# Altium schematic sheet IMX_Supporting Circuits.SchDoc
size A4; SheetNumber: 1; SheetTotal: 8
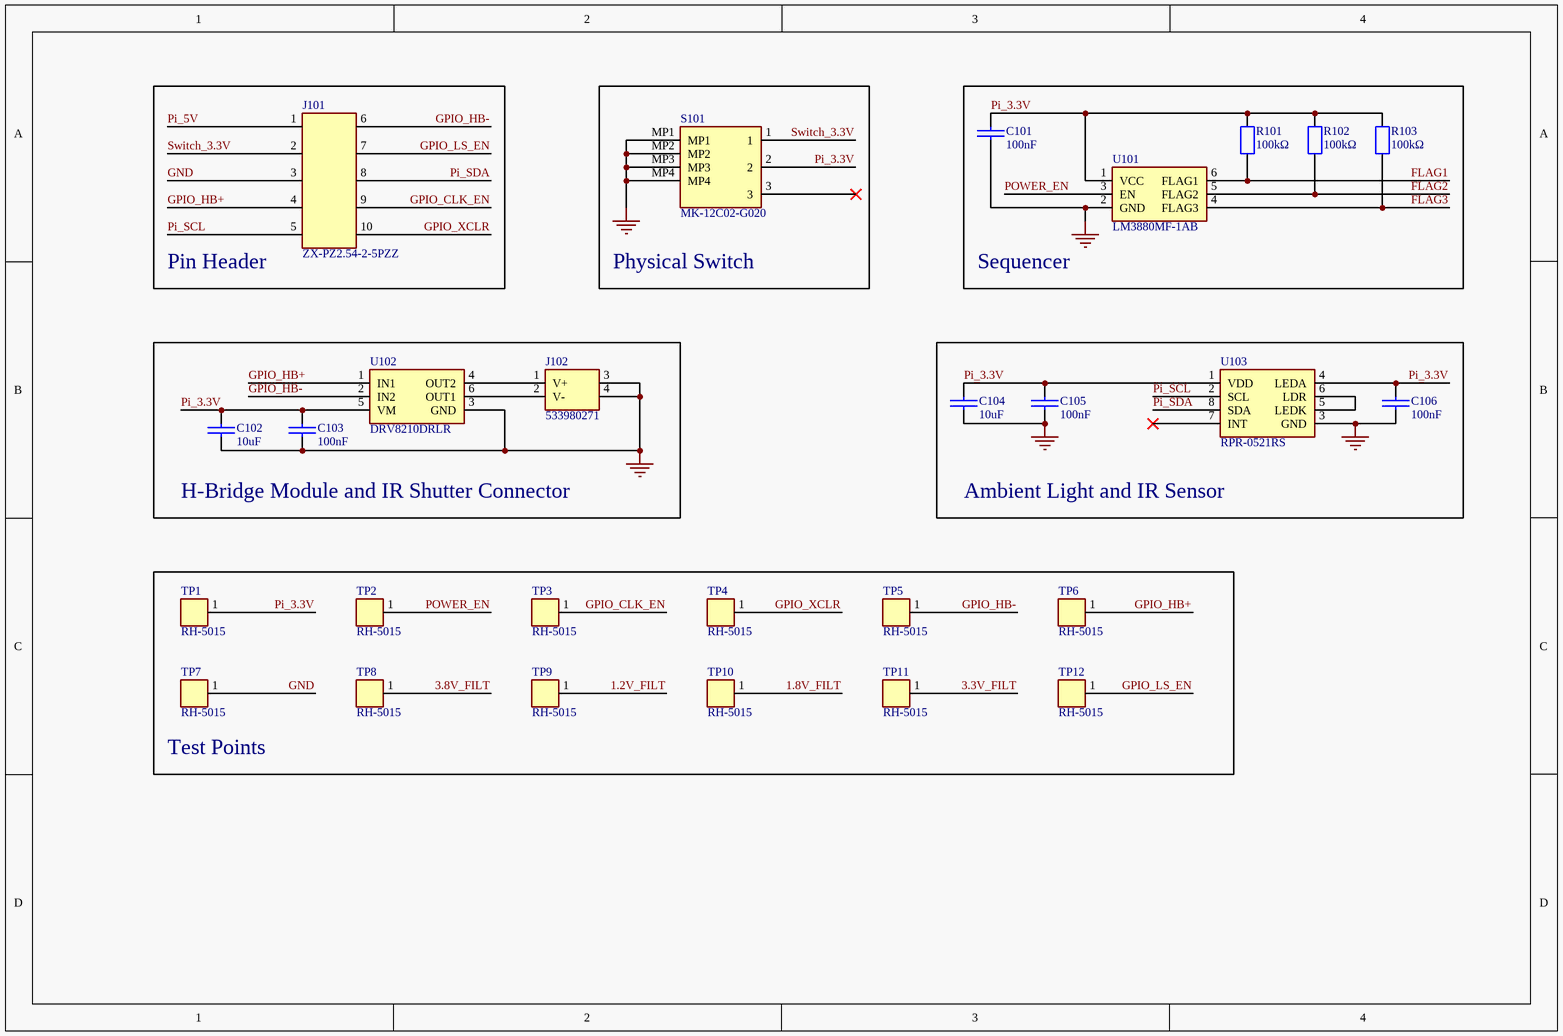
[diagram p0: IMX_Supporting Circuits.SchDoc]

## Parts
C101  100nF  [Capacitor, 0402]
C102  10uF  [Capacitor, 0603]
C103  100nF  [Capacitor, 0402]
C104  10uF  [Capacitor, 0603]
C105  100nF  [Capacitor, 0402]
C106  100nF  [Capacitor, 0402]
J101  ZX-PZ2.54-2-5PZZ  [Pin Header, DIP 2x5, 2.54mm]
J102  533980271  [Molex PicoBlade, Wire To Board 1x2, 533980271]
R101  100kΩ  [Resistor, 0603, Yageo]
R102  100kΩ  [Resistor, 0603, Yageo]
R103  100kΩ  [Resistor, 0603, Yageo]
S101  MK-12C02-G020  [Swich, 1A, Single Pole Double Throw, MK-12C02-G020]
TP1  RH-5015  [Test Point]
TP2  RH-5015  [Test Point]
TP3  RH-5015  [Test Point]
TP4  RH-5015  [Test Point]
TP5  RH-5015  [Test Point]
TP6  RH-5015  [Test Point]
TP7  RH-5015  [Test Point]
TP8  RH-5015  [Test Point]
TP9  RH-5015  [Test Point]
TP10  RH-5015  [Test Point]
TP11  RH-5015  [Test Point]
TP12  RH-5015  [Test Point]
U101  LM3880MF-1AB  [Sequencer, SOT-23]
U102  DRV8210DRLR  [H-Bridge, SOT-563]
U103  RPR-0521RS  [Rohm ALS]

## Blocks framed on the sheet
Pin Header: J101
Physical Switch: S101
Sequencer: C101 R101-R103 U101
H-Bridge Module and IR Shutter Connector: C102 C103 J102 U102
Ambient Light and IR Sensor: C104-C106 U103
Test Points: TP1-TP12

## Nets
GND: C101.2 C102.2 C103.2 C104.2 C105.2 C106.2 J101.3 J102.3 J102.4 S101.MP1 S101.MP2 S101.MP3 S101.MP4 TP7.1 U101.2(GND) U102.3(GND) U103.3(GND)
1.2V_FILT: TP9.1
1.8V_FILT: TP10.1
3.3V_FILT: TP11.1
3.8V_FILT: TP8.1
FLAG1: R101.1 U101.6(FLAG1)
FLAG2: R102.1 U101.5(FLAG2)
FLAG3: R103.1 U101.4(FLAG3)
GPIO_CLK_EN: J101.9 TP3.1
GPIO_HB+: J101.4 TP6.1 U102.1(IN1)
GPIO_HB-: J101.6 TP5.1 U102.2(IN2)
GPIO_LS_EN: J101.7 TP12.1
GPIO_XCLR: J101.10 TP4.1
Pi_3.3V: C101.1 C102.1 C103.1 C104.1 C105.1 C106.1 R101.2 R102.2 R103.2 S101.2 TP1.1 U101.1(VCC) U102.5(VM) U103.1(VDD) U103.4(LEDA)
Pi_5V: J101.1
Pi_SCL: J101.5 U103.2(SCL)
Pi_SDA: J101.8 U103.8(SDA)
POWER_EN: TP2.1 U101.3(EN)
Switch_3.3V: J101.2 S101.1
NetJ102_1: J102.1(V+) U102.4(OUT2)
NetJ102_2: J102.2(V-) U102.6(OUT1)
NetU103_5: U103.5(LEDK) U103.6(LDR)

Not connected (* = marked no-connect by the designer): S101 3*; U103 7(INT)*

## Library data of the parts
C101 C103 C105 C106 = Capacitor, 0402, 100nF: Ceramic Capacitor, 16V, 10% +/- Tol, X7R, 0.1uF, SMD, 0402, #CL05B104KO5NNNC, JLC#C1525; Capacitance: 100nF
C102 C104 = Capacitor, 0603, 10uF: Ceramic Capacitor, 10V, 10% +/- Tol, X7R, 10uF, SMD, 0603, #GRM188Z71A106KA73D, JLC#C2959727; Capacitance: 10uF
J101 = Pin Header, DIP 2x5, 2.54mm: Gold 1kV 3A Direct Insert Policy 2.5mm 10P 6mm -40℃~+105℃ 3mm 2.54mm Brass Double Row Black 2.54mm 2x5P Plugin,P=2.54mm Pin Headers ROHS. #ZX-PZ2.54-2-5PZZ, #C7501276
J102 = Molex PicoBlade, Wire To Board 1x2: 1x2P 2P PicoBlade(MX 1.25) Tin 2 -40℃~+105℃ 1A 1 1.25mm Phosphor Bronze Standing paste SMD,P=1.25mm Wire To Board Connector ROHS, #533980271, JLC#C122410
R101-R103 = Resistor, 0603, 100kΩ: Thick Film Resistor, ±1%, ±100ppm/℃, -55℃~+155℃, 0603, 100kΩ, #RC0603FR-07100KL, JLC#C14675
S101 = Swich, 1A, Single Pole Double Throw: Horizontal attachment 1A Single Pole Double Throw (SPDT) 6V Black 10,000 times SMD Slide Switches ROHS, JLC#C963206
TP1-TP12 = Test Ring: Pogo Pin Spring Probe Connector ROHS, #RH-5015, JLC#C5199798
U101 = Sequencer, 3 Flags, 30ms, 1-2-3/3-2-1: USON-6-EP(2.1x2.1) Ambient Light Sensors ROHS, JLC#C701867; Manufacturer_Name: Texas Instruments; Manufacturer_Part_Number: LM3880MF-1AB/NOPB; Datasheet Link: http://www.ti.com/lit/gpn/lm3880; Height: 1.45mm; Mouser Part Number: 926-LM3880MF1ABNOPB; Mouser Price/Stock: https://www.mouser.co.uk/ProductDetail/Texas-Instruments/LM3880MF-1AB-NOPB?qs=QbsRYf82W3EUDzy5l%252BzEeQ%3D%3D; Arrow Part Number: LM3880MF-1AB/NOPB; Arrow Price/Stock: https://www.arrow.com/en/products/lm3880mf-1abnopb/texas-instruments?region=nac
U102 = H-Bridge, SOT-563: SOT-563 Relay / Coil Drivers ROHS, #DRV8210DRLR, JLC#C3681297
U103 = Rohm ALS: SMD-8P Ambient Light Sensors ROHS, JLC#C509781